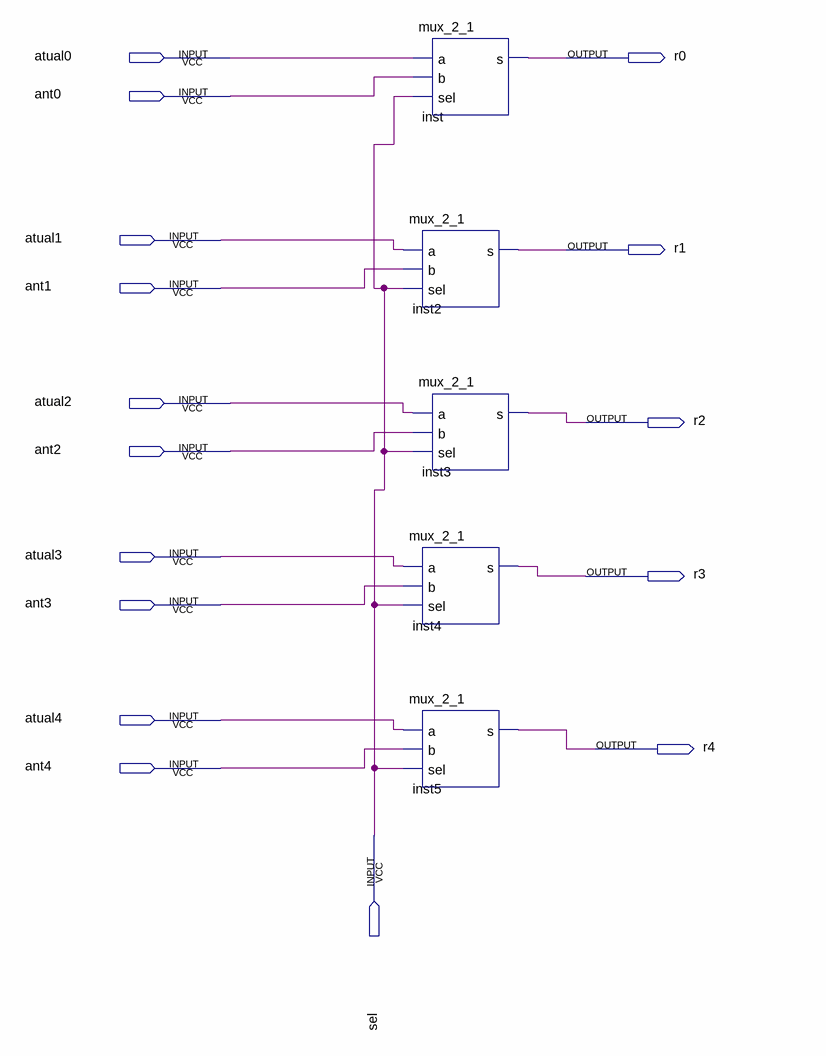
[diagram p0: schematic sheet]
// Quartus schematic mux_10_5.bdf as structural Verilog: 5 symbols, 16 pins
module mux_10_5 (
  input  atual0,
  input  ant0,
  input  atual1,
  input  ant1,
  input  atual2,
  input  ant2,
  input  atual3,
  input  ant3,
  input  atual4,
  input  ant4,
  input  sel,
  output r0,
  output r1,
  output r2,
  output r3,
  output r4
);

  mux_2_1 inst (.a(atual0), .b(ant0), .sel(sel), .s(r0));
  mux_2_1 inst2 (.a(atual1), .b(ant1), .sel(sel), .s(r1));
  mux_2_1 inst3 (.a(atual2), .b(ant2), .sel(sel), .s(r2));
  mux_2_1 inst4 (.a(atual3), .b(ant3), .sel(sel), .s(r3));
  mux_2_1 inst5 (.a(atual4), .b(ant4), .sel(sel), .s(r4));
endmodule
